# Altium schematic sheet B.SchDoc
size A2
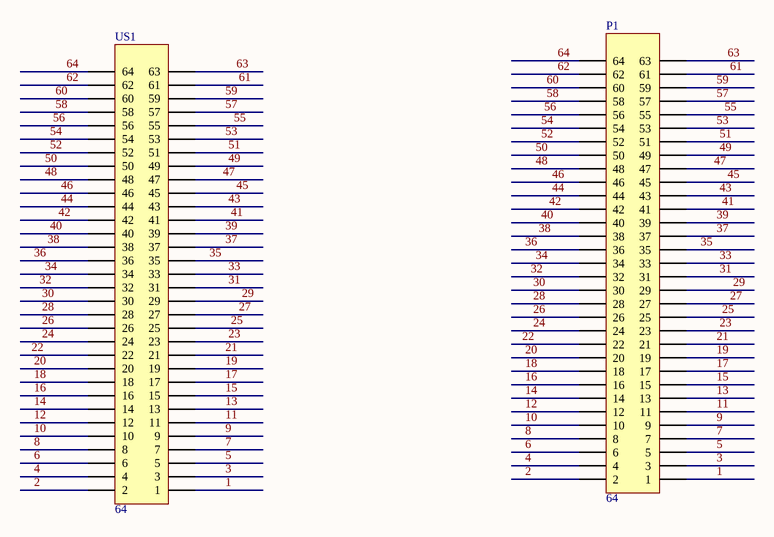
[diagram p0: B.SchDoc]

## Parts
P1  64  [64-1]
US1  64  [TQFP64]

## Nets
1: P1.1 US1.1
2: P1.2 US1.2
3: P1.3 US1.3
4: P1.4 US1.4
5: P1.5 US1.5
6: P1.6 US1.6
7: P1.7 US1.7
8: P1.8 US1.8
9: P1.9 US1.9
10: P1.10 US1.10
11: P1.11 US1.11
12: P1.12 US1.12
13: P1.13 US1.13
14: P1.14 US1.14
15: P1.15 US1.15
16: P1.16 US1.16
17: P1.17 US1.17
18: P1.18 US1.18
19: P1.19 US1.19
20: P1.20 US1.20
21: P1.21 US1.21
22: P1.22 US1.22
23: P1.23 US1.23
24: P1.24 US1.24
25: P1.25 US1.25
26: P1.26 US1.26
27: P1.27 US1.27
28: P1.28 US1.28
29: P1.29 US1.29
30: P1.30 US1.30
31: P1.31 US1.31
32: P1.32 US1.32
33: P1.33 US1.33
34: P1.34 US1.34
35: P1.35 US1.35
36: P1.36 US1.36
37: P1.37 US1.37
38: P1.38 US1.38
39: P1.39 US1.39
40: P1.40 US1.40
41: P1.41 US1.41
42: P1.42 US1.42
43: P1.43 US1.43
44: P1.44 US1.44
45: P1.45 US1.45
46: P1.46 US1.46
47: P1.47 US1.47
48: P1.48 US1.48
49: P1.49 US1.49
50: P1.50 US1.50
51: P1.51 US1.51
52: P1.52 US1.52
53: P1.53 US1.53
54: P1.54 US1.54
55: P1.55 US1.55
56: P1.56 US1.56
57: P1.57 US1.57
58: P1.58 US1.58
59: P1.59 US1.59
60: P1.60 US1.60
61: P1.61 US1.61
62: P1.62 US1.62
63: P1.63 US1.63
64: P1.64 US1.64